# EAGLE schematic schaltung (EAGLE 7.4.0)
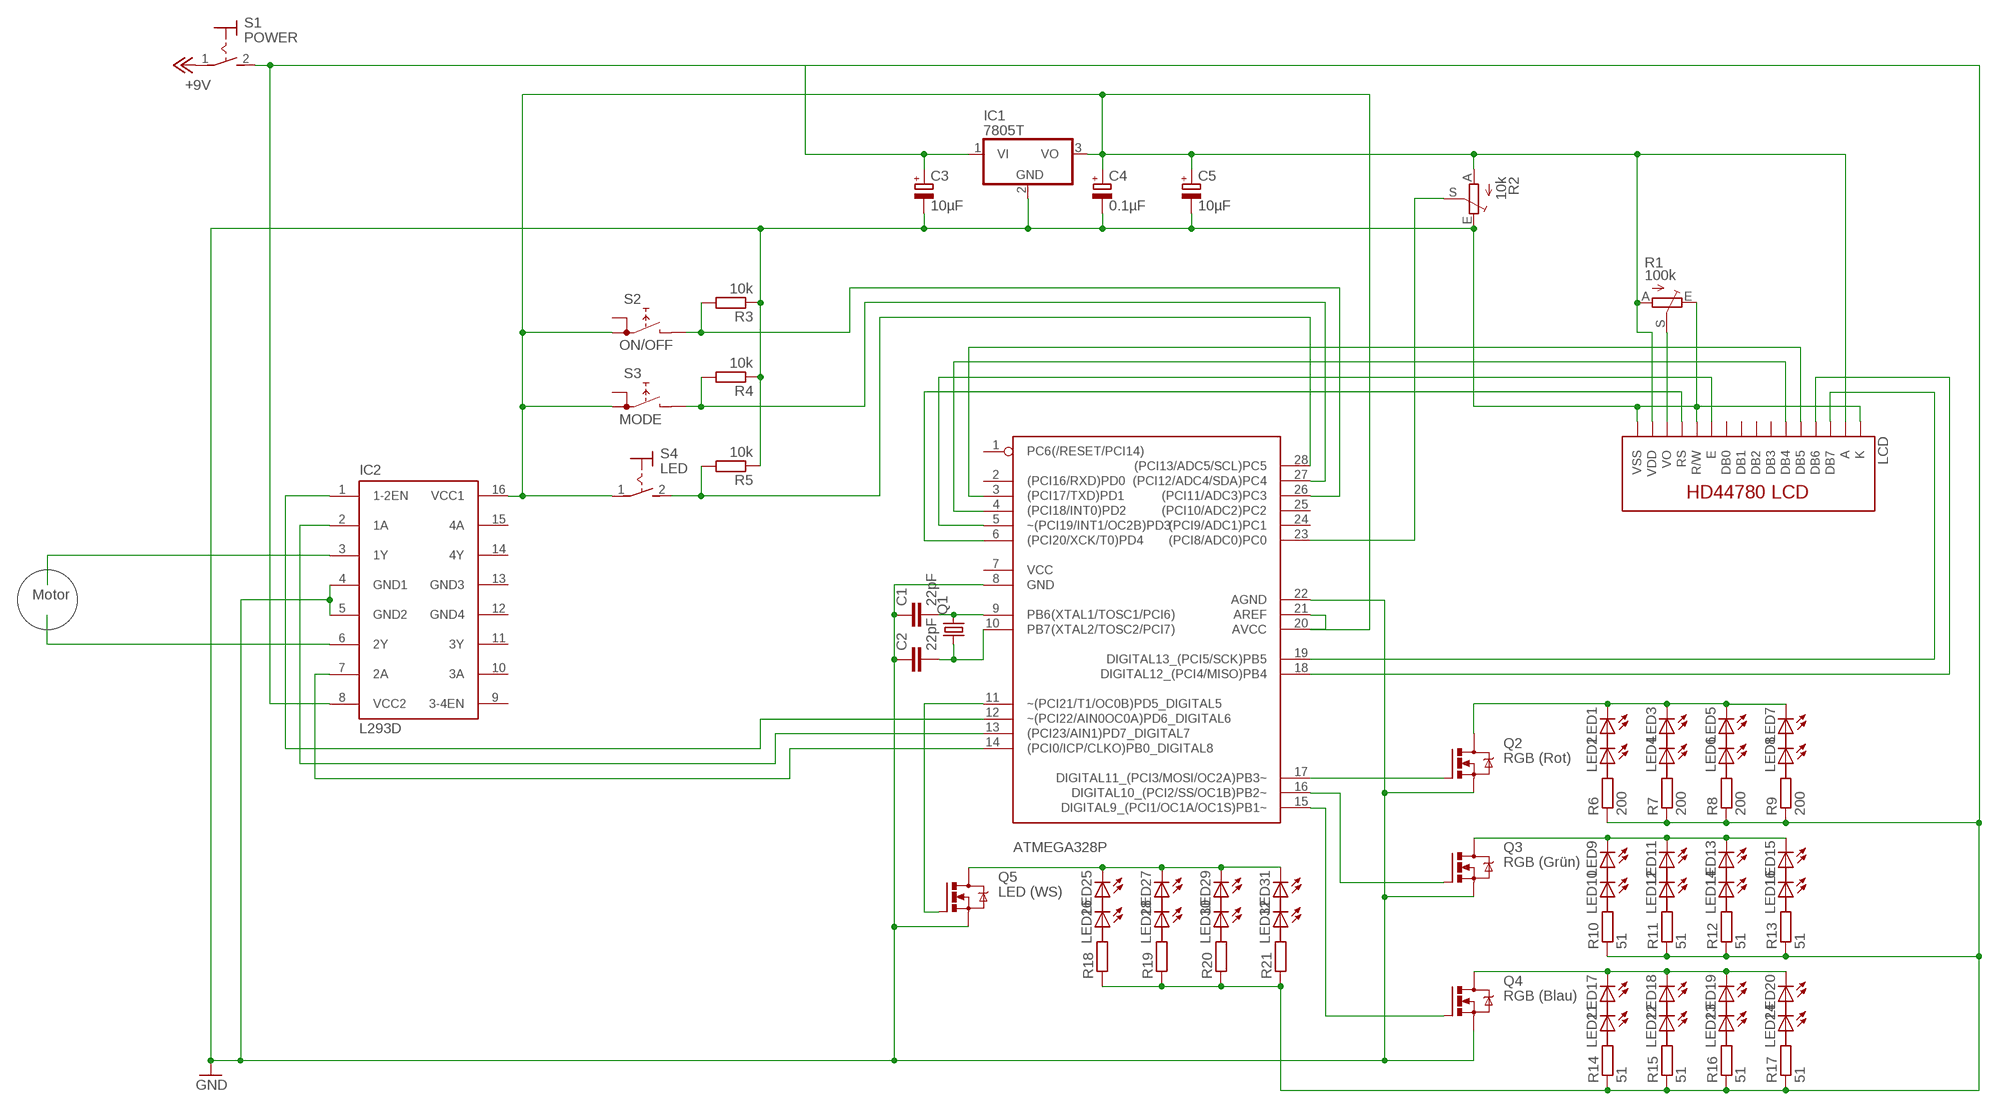
[diagram p0: schematic, sheet 1]

## Parts
ATMEGA328P  ATMEGA328-20P  [DIL28-3]
C1  22pF  C2.5/2  [C2.5-2]
C2  22pF  C2.5/2  [C2.5-2]
C3  10µF  CPOL-EUE2.5-5  [E2,5-5]
C4  0.1µF  CPOL-EUE2.5-5  [E2,5-5]
C5  10µF  CPOL-EUE2.5-5  [E2,5-5]
IC1  7805T  [TO220H]
IC2  L293D  [DIL16]
LCD  LCD-HD447804-HOLES16X2-4-HOLES  [LCD-16X2-4HOLES]
LED1  LED  [SMARTLED-TTW]
LED2  LED  [SMARTLED-TTW]
LED3  LED  [SMARTLED-TTW]
LED4  LED  [SMARTLED-TTW]
LED5  LED  [SMARTLED-TTW]
LED6  LED  [SMARTLED-TTW]
LED7  LED  [SMARTLED-TTW]
LED8  LED  [SMARTLED-TTW]
LED9  LED  [SMARTLED-TTW]
LED10  LED  [SMARTLED-TTW]
LED11  LED  [SMARTLED-TTW]
LED12  LED  [SMARTLED-TTW]
LED13  LED  [SMARTLED-TTW]
LED14  LED  [SMARTLED-TTW]
LED15  LED  [SMARTLED-TTW]
LED16  LED  [SMARTLED-TTW]
LED17  LED  [SMARTLED-TTW]
LED18  LED  [SMARTLED-TTW]
LED19  LED  [SMARTLED-TTW]
LED20  LED  [SMARTLED-TTW]
LED21  LED  [SMARTLED-TTW]
LED22  LED  [SMARTLED-TTW]
LED23  LED  [SMARTLED-TTW]
LED24  LED  [SMARTLED-TTW]
LED25  LED  [SMARTLED-TTW]
LED26  LED  [SMARTLED-TTW]
LED27  LED  [SMARTLED-TTW]
LED28  LED  [SMARTLED-TTW]
LED29  LED  [SMARTLED-TTW]
LED30  LED  [SMARTLED-TTW]
LED31  LED  [SMARTLED-TTW]
LED32  LED  [SMARTLED-TTW]
Q1  CRYSTALHC49S  [HC49/S]
Q2  RGB (Rot)  IRFZ48Z  [TO220BH]
Q3  RGB (Grün)  IRFZ48Z  [TO220BH]
Q4  RGB (Blau)  IRFZ48Z  [TO220BH]
Q5  LED (WS)  IRFZ48Z  [TO220BH]
R1  100k  TRIM_EU-ECP10S  [ECP10S]
R2  10k  TRIM_EU-ECP10S  [ECP10S]
R3  10k  R-EU_0204/5  [0204/5]
R4  10k  R-EU_0204/5  [0204/5]
R5  10k  R-EU_0204/5  [0204/5]
R6  200  R-EU_0204/2V  [0204V]
R7  200  R-EU_0204/2V  [0204V]
R8  200  R-EU_0204/2V  [0204V]
R9  200  R-EU_0204/2V  [0204V]
R10  51  R-EU_0204/2V  [0204V]
R11  51  R-EU_0204/2V  [0204V]
R12  51  R-EU_0204/2V  [0204V]
R13  51  R-EU_0204/2V  [0204V]
R14  51  R-EU_0204/2V  [0204V]
R15  51  R-EU_0204/2V  [0204V]
R16  51  R-EU_0204/2V  [0204V]
R17  51  R-EU_0204/2V  [0204V]
R18  R-EU_0204/2V  [0204V]
R19  R-EU_0204/2V  [0204V]
R20  R-EU_0204/2V  [0204V]
R21  R-EU_0204/2V  [0204V]
S1  POWER  MS243  [MS243]
S2  ON/OFF  RDT1034  [RDT1034]
S3  MODE  RDT1034  [RDT1034]
S4  LED  MS243  [MS243]

## Nets
+12V: S1.1(P) ; supply symbol labelled +9V
GND: ATMEGA328P.8(GND) ATMEGA328P.22(AGND) C1.1 C2.1 C3.- C4.- C5.- IC1.2(GND) IC2.4(GND1) IC2.5(GND2) LCD.1(VSS) LCD.5(R/W) LCD.16(K) Q2.S Q3.S Q4.S Q5.S R1.E R2.E R3.1 R4.1 R5.1
N$1: ATMEGA328P.14((PCI0/ICP/CLKO)PB0_DIGITAL8) IC2.7(2A)
N$2: LED9.C@1(C) LED11.C@1(C) LED13.C@1(C) LED15.C@1(C) Q3.D
N$3: ATMEGA328P.9(PB6(XTAL1/TOSC1/PCI6)) C1.2 Q1.2
N$4: ATMEGA328P.10(PB7(XTAL2/TOSC2/PCI7)) C2.2 Q1.1
N$5: ATMEGA328P.12(~(PCI22/AIN0OC0A)PD6_DIGITAL6) IC2.1(1-2EN)
N$6: ATMEGA328P.13((PCI23/AIN1)PD7_DIGITAL7) IC2.2(1A)
N$7: ATMEGA328P.23((PCI8/ADC0)PC0) R2.S
N$8: C3.+ IC1.1(VI) IC2.8(VCC2) R6.1 R7.1 R8.1 R9.1 R10.1 R11.1 R12.1 R13.1 R14.1 R15.1 R16.1 R17.1 R18.1 R19.1 R20.1 R21.1 S1.2(S)
N$9: LCD.3(VO) R1.S
N$10: ATMEGA328P.26((PCI11/ADC3)PC3) R3.2 S2.B
N$11: ATMEGA328P.5(~(PCI19/INT1/OC2B)PD3) LCD.6(E)
N$12: IC2.3(1Y)
N$13: IC2.6(2Y)
N$14: ATMEGA328P.6((PCI20/XCK/T0)PD4) LCD.4(RS)
N$15: ATMEGA328P.4((PCI18/INT0)PD2) LCD.11(DB4)
N$16: ATMEGA328P.3((PCI17/TXD)PD1) LCD.12(DB5)
N$17: ATMEGA328P.18(DIGITAL12_(PCI4/MISO)PB4) LCD.13(DB6)
N$18: ATMEGA328P.19(DIGITAL13_(PCI5/SCK)PB5) LCD.14(DB7)
N$19: ATMEGA328P.27((PCI12/ADC4/SDA)PC4) R4.2 S3.B
N$20: ATMEGA328P.20(AVCC) ATMEGA328P.21(AREF) C4.+ C5.+ IC1.3(VO) IC2.16(VCC1) LCD.2(VDD) LCD.15(A) R1.A R2.A S2.A1 S3.A1 S4.1(P)
N$21: ATMEGA328P.28((PCI13/ADC5/SCL)PC5) R5.2 S4.2(S)
N$22: ATMEGA328P.17(DIGITAL11_(PCI3/MOSI/OC2A)PB3~) Q2.G
N$23: ATMEGA328P.16(DIGITAL10_(PCI2/SS/OC1B)PB2~) Q3.G
N$24: ATMEGA328P.15(DIGITAL9_(PCI1/OC1A/OC1S)PB1~) Q4.G
N$25: LED1.C@1(C) LED3.C@1(C) LED5.C@1(C) LED7.C@1(C) Q2.D
N$26: LED17.C@1(C) LED18.C@1(C) LED19.C@1(C) LED20.C@1(C) Q4.D
N$27: ATMEGA328P.11(~(PCI21/T1/OC0B)PD5_DIGITAL5) Q5.G
N$28: LED25.C@1(C) LED27.C@1(C) LED29.C@1(C) LED31.C@1(C) Q5.D
Unconnected: ATMEGA328P.1(PC6(/RESET/PCI14)) ATMEGA328P.2((PCI16/RXD)PD0) ATMEGA328P.7(VCC) ATMEGA328P.24((PCI9/ADC1)PC1) ATMEGA328P.25((PCI10/ADC2)PC2) IC2.9(3-4EN) IC2.10(3A) IC2.11(3Y) IC2.14(4Y) IC2.15(4A) LCD.7(DB0) LCD.8(DB1) LCD.9(DB2) LCD.10(DB3) LED1.A@1(A) LED2.A@1(A) LED2.C@1(C) LED3.A@1(A) LED4.A@1(A) LED4.C@1(C) LED5.A@1(A) LED6.A@1(A) LED6.C@1(C) LED7.A@1(A) LED8.A@1(A) LED8.C@1(C) LED9.A@1(A) LED10.A@1(A) LED10.C@1(C) LED11.A@1(A) LED12.A@1(A) LED12.C@1(C) LED13.A@1(A) LED14.A@1(A) LED14.C@1(C) LED15.A@1(A) LED16.A@1(A) LED16.C@1(C) LED17.A@1(A) LED18.A@1(A) LED19.A@1(A) LED20.A@1(A) LED21.A@1(A) LED21.C@1(C) LED22.A@1(A) LED22.C@1(C) LED23.A@1(A) LED23.C@1(C) LED24.A@1(A) LED24.C@1(C) LED25.A@1(A) LED26.A@1(A) LED26.C@1(C) LED27.A@1(A) LED28.A@1(A) LED28.C@1(C) LED29.A@1(A) LED30.A@1(A) LED30.C@1(C) LED31.A@1(A) LED32.A@1(A) LED32.C@1(C) R6.2 R7.2 R8.2 R9.2 R10.2 R11.2 R12.2 R13.2 R14.2 R15.2 R16.2 R17.2 R18.2 R19.2 R20.2 R21.2 S2.A S3.A

## Notes on the sheet
- Motor

## Power pins joined to a net without a drawn wire
GND3: IC2.13(GND3)
GND4: IC2.12(GND4)

## Library data of the parts
ATMEGA328P = atmega328:ATMEGA328*P: MICROCONTROLLER 32 kBytes FLASH 2 kBytes SRAM 1 kBytes EEPROM USART 8-channel 10 bit ADC
C1 C2 = capacitor-wima:C: CAPACITOR naming: grid - package width
C3-C5 = resistor:CPOL-EU: POLARIZED CAPACITOR, European symbol
IC1 = linear:78*: Positive VOLTAGE REGULATOR Source: http://cache.national.com/ds/LM/LM78L05.pdf http://www.fairchildsemi.com/ds/LM/LM7805.pdf
IC2 = st-microelectronics:L293D: PUSH-PULL 4 CHANNEL DRIVER; MPN: L293D; OC_FARNELL: 9589619; OC_NEWARK: 56P8249
LCD = HD44780LCD:LCD-HD44780
LED1-LED32 = led:LED: LED OSRAM: - CHIPLED LG R971, LG N971, LY N971, LG Q971, LY Q971, LO R971, LY R971 LH N974, LH R974 LS Q976, LO Q976, LY Q976 LO Q996 - Hyper CHIPLED LW Q18S LB Q993, LB Q99A, LB R99A - SideLED LS A670, LO A670, LY A670, LG A670, LP A670 LB A673, LV A673, LT A673, LW A673 LH A674 LY A675 LS A676, LA A676, LO A676, LY A676, LW A676 LS A679, LY A679, LG A679 - Hyper Micro SIDELED® LS Y876, LA Y876, LO Y876, LY Y876 LT Y87S - SmartLED LW L88C, LW L88S LB L89C, LB L89S, LG L890 LS L89K, LO L89K, LY L89K LS L896, LA L896, LO L896, LY L896 - TOPLED LS T670, LO T670, LY T670, LG T670, LP T670 LSG T670, LSP T670, LSY T670, LOP T670, LYG T670 LG T671, LOG T671, LSG T671 LB T673, LV T673, LT T673, LW T673 LH T674 LS T676, LA T676, LO T676, LY T676, LB T676, LH T676, LSB T676, LW T676 LB T67C, LV T67C, LT T67C, LS T67K, LO T67K, LY T67K, LW E67C LS E67B, LA E67B, LO E67B, LY E67B, LB E67C, LV E67C, LT E67C LW T67C LS T679, LY T679, LG T679 LS T770, LO T770, LY T770, LG T770, LP T770 LB T773, LV T773, LT T773, LW T773 LH T774 LS E675, LA E675, LY E675, LS T675 LS T776, LA T776, LO T776, LY T776, LB T776 LHGB T686 LT T68C, LB T68C - Hyper Mini TOPLED® LB M676 - Mini TOPLED Santana® LG M470 LS M47K, LO M47K, LY M47K Source: http://www.osram.convergy.de LUXEON: - LUMILED® LXK2-PW12-R00, LXK2-PW12-S00, LXK2-PW14-U00, LXK2-PW14-V00 LXK2-PM12-R00, LXK2-PM12-S00, LXK2-PM14-U00 LXK2-PE12-Q00, LXK2-PE12-R00, LXK2-PE12-S00, LXK2-PE14-T00, LXK2-PE14-U00 LXK2-PB12-K00, LXK2-PB12-L00, LXK2-PB12-M00, LXK2-PB14-N00, LXK2-PB14-P00, LXK2-PB14-Q00 LXK2-PR12-L00, LXK2-PR12-M00, LXK2-PR14-Q00, LXK2-PR14-R00 LXK2-PD12-Q00, LXK2-PD12-R00, LXK2-PD12-S00 LXK2-PH12-R00, LXK2-PH12-S00 LXK2-PL12-P00, LXK2-PL12-Q00, LXK2-PL12-R00 Source: www.luxeon.com KINGBRIGHT: KA-3528ASYC Source: www.kingbright.com
Q1 = crystal:CRYSTAL: CRYSTAL; OC_FARNELL: 1667008; OC_NEWARK: unknown
Q2-Q5 = transistor-power:IRFZ48: N Channel HEXFET® Power MOSFET Logic Level Source: http://www.irf.com/product-info/datasheets/data/irfz48z.pdf
R1 R2 = pot:TRIM_EU-: POTENTIOMETER
R3-R21 = resistor:R-EU_: RESISTOR, European symbol
S1 S4 = switch:MS243: TOGGLE SWITCH
S2 S3 = switch:RDT1034: PUSH SWITCH www.radiohm.com